# EasyEDA Pro project 06_B&RLight.epro

# Schematic Schematic1
Create Date: 2024-04-08; Page Name: P1; Project Name: Light; Schematic Name: Schematic1; Update Date: 2024-07-20; Company: 嘉立创EDA; Page Size: A3; Version: V1.0
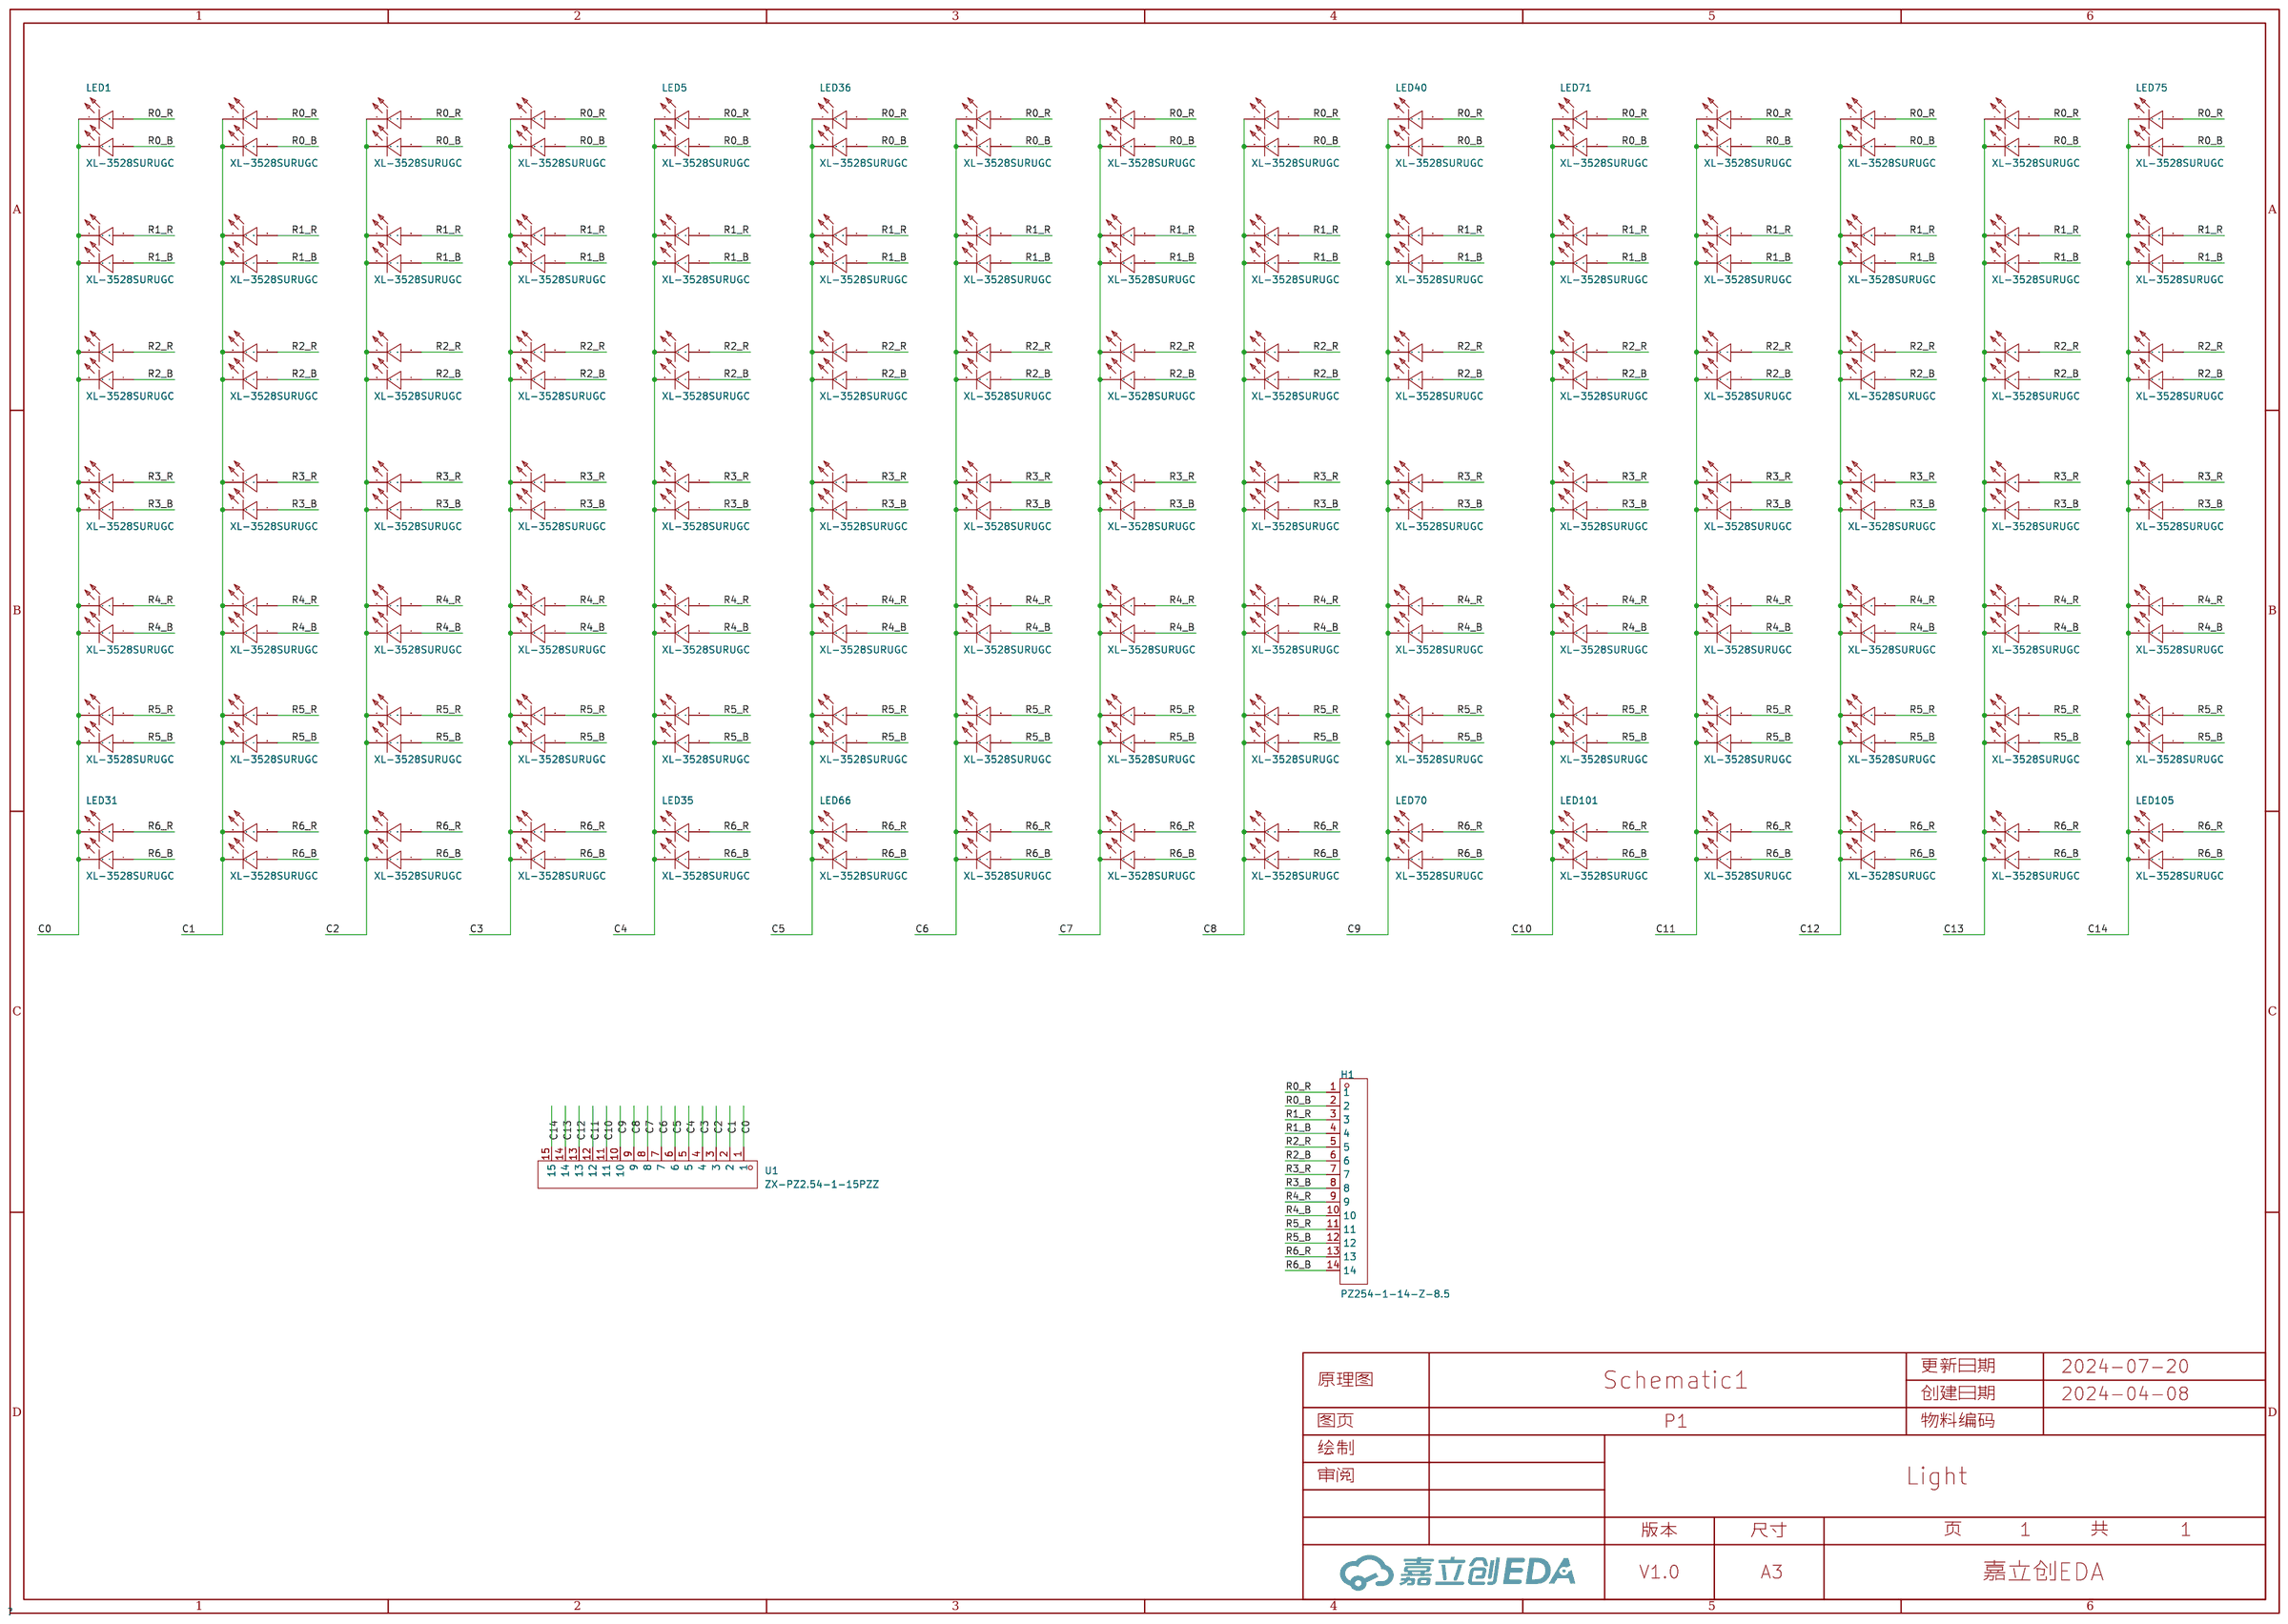
[diagram p0: schematic sheet]

## Parts
H1  PZ254-1-14-Z-8.5  [HDR-TH_14P-P2.54-V-M]
LED1  XL-3528SURUGC  [LED-SMD_4P-L3.2-W2.8-LS3.5-TL]
LED2  XL-3528SURUGC  [LED-SMD_4P-L3.2-W2.8-LS3.5-TL]
LED3  XL-3528SURUGC  [LED-SMD_4P-L3.2-W2.8-LS3.5-TL]
LED4  XL-3528SURUGC  [LED-SMD_4P-L3.2-W2.8-LS3.5-TL]
LED5  XL-3528SURUGC  [LED-SMD_4P-L3.2-W2.8-LS3.5-TL]
LED6  XL-3528SURUGC  [LED-SMD_4P-L3.2-W2.8-LS3.5-TL]
LED7  XL-3528SURUGC  [LED-SMD_4P-L3.2-W2.8-LS3.5-TL]
LED8  XL-3528SURUGC  [LED-SMD_4P-L3.2-W2.8-LS3.5-TL]
LED9  XL-3528SURUGC  [LED-SMD_4P-L3.2-W2.8-LS3.5-TL]
LED10  XL-3528SURUGC  [LED-SMD_4P-L3.2-W2.8-LS3.5-TL]
LED11  XL-3528SURUGC  [LED-SMD_4P-L3.2-W2.8-LS3.5-TL]
LED12  XL-3528SURUGC  [LED-SMD_4P-L3.2-W2.8-LS3.5-TL]
LED13  XL-3528SURUGC  [LED-SMD_4P-L3.2-W2.8-LS3.5-TL]
LED14  XL-3528SURUGC  [LED-SMD_4P-L3.2-W2.8-LS3.5-TL]
LED15  XL-3528SURUGC  [LED-SMD_4P-L3.2-W2.8-LS3.5-TL]
LED16  XL-3528SURUGC  [LED-SMD_4P-L3.2-W2.8-LS3.5-TL]
LED17  XL-3528SURUGC  [LED-SMD_4P-L3.2-W2.8-LS3.5-TL]
LED18  XL-3528SURUGC  [LED-SMD_4P-L3.2-W2.8-LS3.5-TL]
LED19  XL-3528SURUGC  [LED-SMD_4P-L3.2-W2.8-LS3.5-TL]
LED20  XL-3528SURUGC  [LED-SMD_4P-L3.2-W2.8-LS3.5-TL]
LED21  XL-3528SURUGC  [LED-SMD_4P-L3.2-W2.8-LS3.5-TL]
LED22  XL-3528SURUGC  [LED-SMD_4P-L3.2-W2.8-LS3.5-TL]
LED23  XL-3528SURUGC  [LED-SMD_4P-L3.2-W2.8-LS3.5-TL]
LED24  XL-3528SURUGC  [LED-SMD_4P-L3.2-W2.8-LS3.5-TL]
LED25  XL-3528SURUGC  [LED-SMD_4P-L3.2-W2.8-LS3.5-TL]
LED26  XL-3528SURUGC  [LED-SMD_4P-L3.2-W2.8-LS3.5-TL]
LED27  XL-3528SURUGC  [LED-SMD_4P-L3.2-W2.8-LS3.5-TL]
LED28  XL-3528SURUGC  [LED-SMD_4P-L3.2-W2.8-LS3.5-TL]
LED29  XL-3528SURUGC  [LED-SMD_4P-L3.2-W2.8-LS3.5-TL]
LED30  XL-3528SURUGC  [LED-SMD_4P-L3.2-W2.8-LS3.5-TL]
LED31  XL-3528SURUGC  [LED-SMD_4P-L3.2-W2.8-LS3.5-TL]
LED32  XL-3528SURUGC  [LED-SMD_4P-L3.2-W2.8-LS3.5-TL]
LED33  XL-3528SURUGC  [LED-SMD_4P-L3.2-W2.8-LS3.5-TL]
LED34  XL-3528SURUGC  [LED-SMD_4P-L3.2-W2.8-LS3.5-TL]
LED35  XL-3528SURUGC  [LED-SMD_4P-L3.2-W2.8-LS3.5-TL]
LED36  XL-3528SURUGC  [LED-SMD_4P-L3.2-W2.8-LS3.5-TL]
LED37  XL-3528SURUGC  [LED-SMD_4P-L3.2-W2.8-LS3.5-TL]
LED38  XL-3528SURUGC  [LED-SMD_4P-L3.2-W2.8-LS3.5-TL]
LED39  XL-3528SURUGC  [LED-SMD_4P-L3.2-W2.8-LS3.5-TL]
LED40  XL-3528SURUGC  [LED-SMD_4P-L3.2-W2.8-LS3.5-TL]
LED41  XL-3528SURUGC  [LED-SMD_4P-L3.2-W2.8-LS3.5-TL]
LED42  XL-3528SURUGC  [LED-SMD_4P-L3.2-W2.8-LS3.5-TL]
LED43  XL-3528SURUGC  [LED-SMD_4P-L3.2-W2.8-LS3.5-TL]
LED44  XL-3528SURUGC  [LED-SMD_4P-L3.2-W2.8-LS3.5-TL]
LED45  XL-3528SURUGC  [LED-SMD_4P-L3.2-W2.8-LS3.5-TL]
LED46  XL-3528SURUGC  [LED-SMD_4P-L3.2-W2.8-LS3.5-TL]
LED47  XL-3528SURUGC  [LED-SMD_4P-L3.2-W2.8-LS3.5-TL]
LED48  XL-3528SURUGC  [LED-SMD_4P-L3.2-W2.8-LS3.5-TL]
LED49  XL-3528SURUGC  [LED-SMD_4P-L3.2-W2.8-LS3.5-TL]
LED50  XL-3528SURUGC  [LED-SMD_4P-L3.2-W2.8-LS3.5-TL]
LED51  XL-3528SURUGC  [LED-SMD_4P-L3.2-W2.8-LS3.5-TL]
LED52  XL-3528SURUGC  [LED-SMD_4P-L3.2-W2.8-LS3.5-TL]
LED53  XL-3528SURUGC  [LED-SMD_4P-L3.2-W2.8-LS3.5-TL]
LED54  XL-3528SURUGC  [LED-SMD_4P-L3.2-W2.8-LS3.5-TL]
LED55  XL-3528SURUGC  [LED-SMD_4P-L3.2-W2.8-LS3.5-TL]
LED56  XL-3528SURUGC  [LED-SMD_4P-L3.2-W2.8-LS3.5-TL]
LED57  XL-3528SURUGC  [LED-SMD_4P-L3.2-W2.8-LS3.5-TL]
LED58  XL-3528SURUGC  [LED-SMD_4P-L3.2-W2.8-LS3.5-TL]
LED59  XL-3528SURUGC  [LED-SMD_4P-L3.2-W2.8-LS3.5-TL]
LED60  XL-3528SURUGC  [LED-SMD_4P-L3.2-W2.8-LS3.5-TL]
LED61  XL-3528SURUGC  [LED-SMD_4P-L3.2-W2.8-LS3.5-TL]
LED62  XL-3528SURUGC  [LED-SMD_4P-L3.2-W2.8-LS3.5-TL]
LED63  XL-3528SURUGC  [LED-SMD_4P-L3.2-W2.8-LS3.5-TL]
LED64  XL-3528SURUGC  [LED-SMD_4P-L3.2-W2.8-LS3.5-TL]
LED65  XL-3528SURUGC  [LED-SMD_4P-L3.2-W2.8-LS3.5-TL]
LED66  XL-3528SURUGC  [LED-SMD_4P-L3.2-W2.8-LS3.5-TL]
LED67  XL-3528SURUGC  [LED-SMD_4P-L3.2-W2.8-LS3.5-TL]
LED68  XL-3528SURUGC  [LED-SMD_4P-L3.2-W2.8-LS3.5-TL]
LED69  XL-3528SURUGC  [LED-SMD_4P-L3.2-W2.8-LS3.5-TL]
LED70  XL-3528SURUGC  [LED-SMD_4P-L3.2-W2.8-LS3.5-TL]
LED71  XL-3528SURUGC  [LED-SMD_4P-L3.2-W2.8-LS3.5-TL]
LED72  XL-3528SURUGC  [LED-SMD_4P-L3.2-W2.8-LS3.5-TL]
LED73  XL-3528SURUGC  [LED-SMD_4P-L3.2-W2.8-LS3.5-TL]
LED74  XL-3528SURUGC  [LED-SMD_4P-L3.2-W2.8-LS3.5-TL]
LED75  XL-3528SURUGC  [LED-SMD_4P-L3.2-W2.8-LS3.5-TL]
LED76  XL-3528SURUGC  [LED-SMD_4P-L3.2-W2.8-LS3.5-TL]
LED77  XL-3528SURUGC  [LED-SMD_4P-L3.2-W2.8-LS3.5-TL]
LED78  XL-3528SURUGC  [LED-SMD_4P-L3.2-W2.8-LS3.5-TL]
LED79  XL-3528SURUGC  [LED-SMD_4P-L3.2-W2.8-LS3.5-TL]
LED80  XL-3528SURUGC  [LED-SMD_4P-L3.2-W2.8-LS3.5-TL]
LED81  XL-3528SURUGC  [LED-SMD_4P-L3.2-W2.8-LS3.5-TL]
LED82  XL-3528SURUGC  [LED-SMD_4P-L3.2-W2.8-LS3.5-TL]
LED83  XL-3528SURUGC  [LED-SMD_4P-L3.2-W2.8-LS3.5-TL]
LED84  XL-3528SURUGC  [LED-SMD_4P-L3.2-W2.8-LS3.5-TL]
LED85  XL-3528SURUGC  [LED-SMD_4P-L3.2-W2.8-LS3.5-TL]
LED86  XL-3528SURUGC  [LED-SMD_4P-L3.2-W2.8-LS3.5-TL]
LED87  XL-3528SURUGC  [LED-SMD_4P-L3.2-W2.8-LS3.5-TL]
LED88  XL-3528SURUGC  [LED-SMD_4P-L3.2-W2.8-LS3.5-TL]
LED89  XL-3528SURUGC  [LED-SMD_4P-L3.2-W2.8-LS3.5-TL]
LED90  XL-3528SURUGC  [LED-SMD_4P-L3.2-W2.8-LS3.5-TL]
LED91  XL-3528SURUGC  [LED-SMD_4P-L3.2-W2.8-LS3.5-TL]
LED92  XL-3528SURUGC  [LED-SMD_4P-L3.2-W2.8-LS3.5-TL]
LED93  XL-3528SURUGC  [LED-SMD_4P-L3.2-W2.8-LS3.5-TL]
LED94  XL-3528SURUGC  [LED-SMD_4P-L3.2-W2.8-LS3.5-TL]
LED95  XL-3528SURUGC  [LED-SMD_4P-L3.2-W2.8-LS3.5-TL]
LED96  XL-3528SURUGC  [LED-SMD_4P-L3.2-W2.8-LS3.5-TL]
LED97  XL-3528SURUGC  [LED-SMD_4P-L3.2-W2.8-LS3.5-TL]
LED98  XL-3528SURUGC  [LED-SMD_4P-L3.2-W2.8-LS3.5-TL]
LED99  XL-3528SURUGC  [LED-SMD_4P-L3.2-W2.8-LS3.5-TL]
LED100  XL-3528SURUGC  [LED-SMD_4P-L3.2-W2.8-LS3.5-TL]
LED101  XL-3528SURUGC  [LED-SMD_4P-L3.2-W2.8-LS3.5-TL]
LED102  XL-3528SURUGC  [LED-SMD_4P-L3.2-W2.8-LS3.5-TL]
LED103  XL-3528SURUGC  [LED-SMD_4P-L3.2-W2.8-LS3.5-TL]
LED104  XL-3528SURUGC  [LED-SMD_4P-L3.2-W2.8-LS3.5-TL]
LED105  XL-3528SURUGC  [LED-SMD_4P-L3.2-W2.8-LS3.5-TL]
U1  ZX-PZ2.54-1-15PZZ  [HDR-TH_15P-P2.54-V-M]

## Library data of the parts
H1 = PZ254-1-14-Z-8.5: 插针结构:1x14P;间距:2.54mm;行距:-;圆针/方针:方针;安装类型:直插;排数:单排;总PIN位数:14P;额定电流:3A;额定电压:-;配合针长度:6mm;塑高:2.5mm;端接针长度:3mm;触头材质:黄铜;工作温度范围:-40℃~+105℃;焊接温度(最大值):260℃@10S;颜色:黑色;; LCSC Part Name: 1x14P 间距:2.54mm 方针 直插; Supplier Part: C2894937; Manufacturer: HCTL(华灿天禄); Supplier Footprint: 插件,P=2.54mm; JLCPCB Part Class: Extended Part; Datasheet: https://atta.szlcsc.com/upload/public/pdf/source/20240305/0F0A2A5C422E5D195558C9C26715A031.pdf; Supplier: LCSC; Pin Structure: 1x14P; Pitch: 2.54mm; Circluar Pins/Square Pins: 方针; Mounting Type: 直插; Number of Rows: 单排; Number of Pins: 14P; Current Rating (Max): 3A; Length of Mating Pin: 6mm; Insulation Height: 2.5mm; Length of End Connection Pin: 3mm; Contact Material: 黄铜; Operating Temperature Range: -40℃~+105℃; Soldering Temperature(Max): 260℃@10S; Color: 黑色
LED1-LED105 = XL-3528SURUGC: 发光颜色:红色,翠绿色;功率:90mW；90mW;正向电流:30mA;主波长:520nm~522.5nm；620nm~625nm;二极管配置:-;透镜颜色:无色透明透镜;发光角度:120°;载带方式:正贴;工作温度:-30℃~+85℃;; Supplier Part: C2843810; Manufacturer: XINGLIGHT(成兴光); Supplier Footprint: SMD3528; JLCPCB Part Class: 扩展库; Datasheet: https://atta.szlcsc.com/upload/public/pdf/source/20221102/F90D461D3395F167E4A274E460079459.pdf; Supplier: LCSC; Emitted Color: 红色,翠绿色; Power Dissipation: 90mW；90mW; Forward Current: 30mA; Dominant Wavelength: 520nm~522.5nm；620nm~625nm; Peak Wavelength: 522.5nm；625nm; Lens Color: 无色透明透镜; Viewing Angle: 120°; Mounting Sytle: 正贴; Operating Temperature: -30℃~+85℃
U1 = ZX-PZ2.54-1-15PZZ: 插针结构:1x15P;间距:2.54mm;行距:-;圆针/方针:方针;安装类型:直插;排数:单排;总PIN位数:15P;额定电流:3A;额定电压:1kV;配合针长度:6mm;塑高:2.5mm;端接针长度:3mm;触头材质:黄铜;触头镀层:金;工作温度范围:-40℃~+105℃;焊接温度(最大值):-;颜色:黑色;; LCSC Part Name: 1x15P 间距:2.54mm 方针 直插; Supplier Part: C7501269; Manufacturer: Megastar(兆星); Supplier Footprint: 插件,P=2.54mm; JLCPCB Part Class: Extended Part; Datasheet: https://atta.szlcsc.com/upload/public/pdf/source/20231122/A1A587BCB61FD4E661A7B23F28C6B7B8.pdf; Supplier: LCSC; Pin Structure: 1x15P; Pitch: 2.54mm; Circluar Pins/Square Pins: 方针; Mounting Type: 直插; Number of Rows: 单排; Number of Pins: 15P; Current Rating (Max): 3A; Voltage Rating (Max): 1kV; Length of Mating Pin: 6mm; Insulation Height: 2.5mm; Length of End Connection Pin: 3mm; Contact Material: 黄铜; Contact Plating: 金; Operating Temperature Range: -40℃~+105℃; Color: 黑色

## Nets
C0: LED1.1 LED1.3 LED6.1 LED6.3 LED11.1 LED11.3 LED16.1 LED16.3 LED21.1 LED21.3 LED26.1 LED26.3 LED31.1 LED31.3 U1.1
C1: LED2.1 LED2.3 LED7.1 LED7.3 LED12.1 LED12.3 LED17.1 LED17.3 LED22.1 LED22.3 LED27.1 LED27.3 LED32.1 LED32.3 U1.2
C2: LED3.1 LED3.3 LED8.1 LED8.3 LED13.1 LED13.3 LED18.1 LED18.3 LED23.1 LED23.3 LED28.1 LED28.3 LED33.1 LED33.3 U1.3
C3: LED4.1 LED4.3 LED9.1 LED9.3 LED14.1 LED14.3 LED19.1 LED19.3 LED24.1 LED24.3 LED29.1 LED29.3 LED34.1 LED34.3 U1.4
C4: LED5.1 LED5.3 LED10.1 LED10.3 LED15.1 LED15.3 LED20.1 LED20.3 LED25.1 LED25.3 LED30.1 LED30.3 LED35.1 LED35.3 U1.5
C5: LED36.1 LED36.3 LED41.1 LED41.3 LED46.1 LED46.3 LED51.1 LED51.3 LED56.1 LED56.3 LED61.1 LED61.3 LED66.1 LED66.3 U1.6
C6: LED37.1 LED37.3 LED42.1 LED42.3 LED47.1 LED47.3 LED52.1 LED52.3 LED57.1 LED57.3 LED62.1 LED62.3 LED67.1 LED67.3 U1.7
C7: LED38.1 LED38.3 LED43.1 LED43.3 LED48.1 LED48.3 LED53.1 LED53.3 LED58.1 LED58.3 LED63.1 LED63.3 LED68.1 LED68.3 U1.8
C8: LED39.1 LED39.3 LED44.1 LED44.3 LED49.1 LED49.3 LED54.1 LED54.3 LED59.1 LED59.3 LED64.1 LED64.3 LED69.1 LED69.3 U1.9
C9: LED40.1 LED40.3 LED45.1 LED45.3 LED50.1 LED50.3 LED55.1 LED55.3 LED60.1 LED60.3 LED65.1 LED65.3 LED70.1 LED70.3 U1.10
C10: LED71.1 LED71.3 LED76.1 LED76.3 LED81.1 LED81.3 LED86.1 LED86.3 LED91.1 LED91.3 LED96.1 LED96.3 LED101.1 LED101.3 U1.11
C11: LED72.1 LED72.3 LED77.1 LED77.3 LED82.1 LED82.3 LED87.1 LED87.3 LED92.1 LED92.3 LED97.1 LED97.3 LED102.1 LED102.3 U1.12
C12: LED73.1 LED73.3 LED78.1 LED78.3 LED83.1 LED83.3 LED88.1 LED88.3 LED93.1 LED93.3 LED98.1 LED98.3 LED103.1 LED103.3 U1.13
C13: LED74.1 LED74.3 LED79.1 LED79.3 LED84.1 LED84.3 LED89.1 LED89.3 LED94.1 LED94.3 LED99.1 LED99.3 LED104.1 LED104.3 U1.14
C14: LED75.1 LED75.3 LED80.1 LED80.3 LED85.1 LED85.3 LED90.1 LED90.3 LED95.1 LED95.3 LED100.1 LED100.3 LED105.1 LED105.3 U1.15
R0_B: H1.2 LED1.4 LED2.4 LED3.4 LED4.4 LED5.4 LED36.4 LED37.4 LED38.4 LED39.4 LED40.4 LED71.4 LED72.4 LED73.4 LED74.4 LED75.4
R0_R: H1.1 LED1.2 LED2.2 LED3.2 LED4.2 LED5.2 LED36.2 LED37.2 LED38.2 LED39.2 LED40.2 LED71.2 LED72.2 LED73.2 LED74.2 LED75.2
R1_B: H1.4 LED6.4 LED7.4 LED8.4 LED9.4 LED10.4 LED41.4 LED42.4 LED43.4 LED44.4 LED45.4 LED76.4 LED77.4 LED78.4 LED79.4 LED80.4
R1_R: H1.3 LED6.2 LED7.2 LED8.2 LED9.2 LED10.2 LED41.2 LED42.2 LED43.2 LED44.2 LED45.2 LED76.2 LED77.2 LED78.2 LED79.2 LED80.2
R2_B: H1.6 LED11.4 LED12.4 LED13.4 LED14.4 LED15.4 LED46.4 LED47.4 LED48.4 LED49.4 LED50.4 LED81.4 LED82.4 LED83.4 LED84.4 LED85.4
R2_R: H1.5 LED11.2 LED12.2 LED13.2 LED14.2 LED15.2 LED46.2 LED47.2 LED48.2 LED49.2 LED50.2 LED81.2 LED82.2 LED83.2 LED84.2 LED85.2
R3_B: H1.8 LED16.4 LED17.4 LED18.4 LED19.4 LED20.4 LED51.4 LED52.4 LED53.4 LED54.4 LED55.4 LED86.4 LED87.4 LED88.4 LED89.4 LED90.4
R3_R: H1.7 LED16.2 LED17.2 LED18.2 LED19.2 LED20.2 LED51.2 LED52.2 LED53.2 LED54.2 LED55.2 LED86.2 LED87.2 LED88.2 LED89.2 LED90.2
R4_B: H1.10 LED21.4 LED22.4 LED23.4 LED24.4 LED25.4 LED56.4 LED57.4 LED58.4 LED59.4 LED60.4 LED91.4 LED92.4 LED93.4 LED94.4 LED95.4
R4_R: H1.9 LED21.2 LED22.2 LED23.2 LED24.2 LED25.2 LED56.2 LED57.2 LED58.2 LED59.2 LED60.2 LED91.2 LED92.2 LED93.2 LED94.2 LED95.2
R5_B: H1.12 LED26.4 LED27.4 LED28.4 LED29.4 LED30.4 LED61.4 LED62.4 LED63.4 LED64.4 LED65.4 LED96.4 LED97.4 LED98.4 LED99.4 LED100.4
R5_R: H1.11 LED26.2 LED27.2 LED28.2 LED29.2 LED30.2 LED61.2 LED62.2 LED63.2 LED64.2 LED65.2 LED96.2 LED97.2 LED98.2 LED99.2 LED100.2
R6_B: H1.14 LED31.4 LED32.4 LED33.4 LED34.4 LED35.4 LED66.4 LED67.4 LED68.4 LED69.4 LED70.4 LED101.4 LED102.4 LED103.4 LED104.4 LED105.4
R6_R: H1.13 LED31.2 LED32.2 LED33.2 LED34.2 LED35.2 LED66.2 LED67.2 LED68.2 LED69.2 LED70.2 LED101.2 LED102.2 LED103.2 LED104.2 LED105.2

# Board PCB1
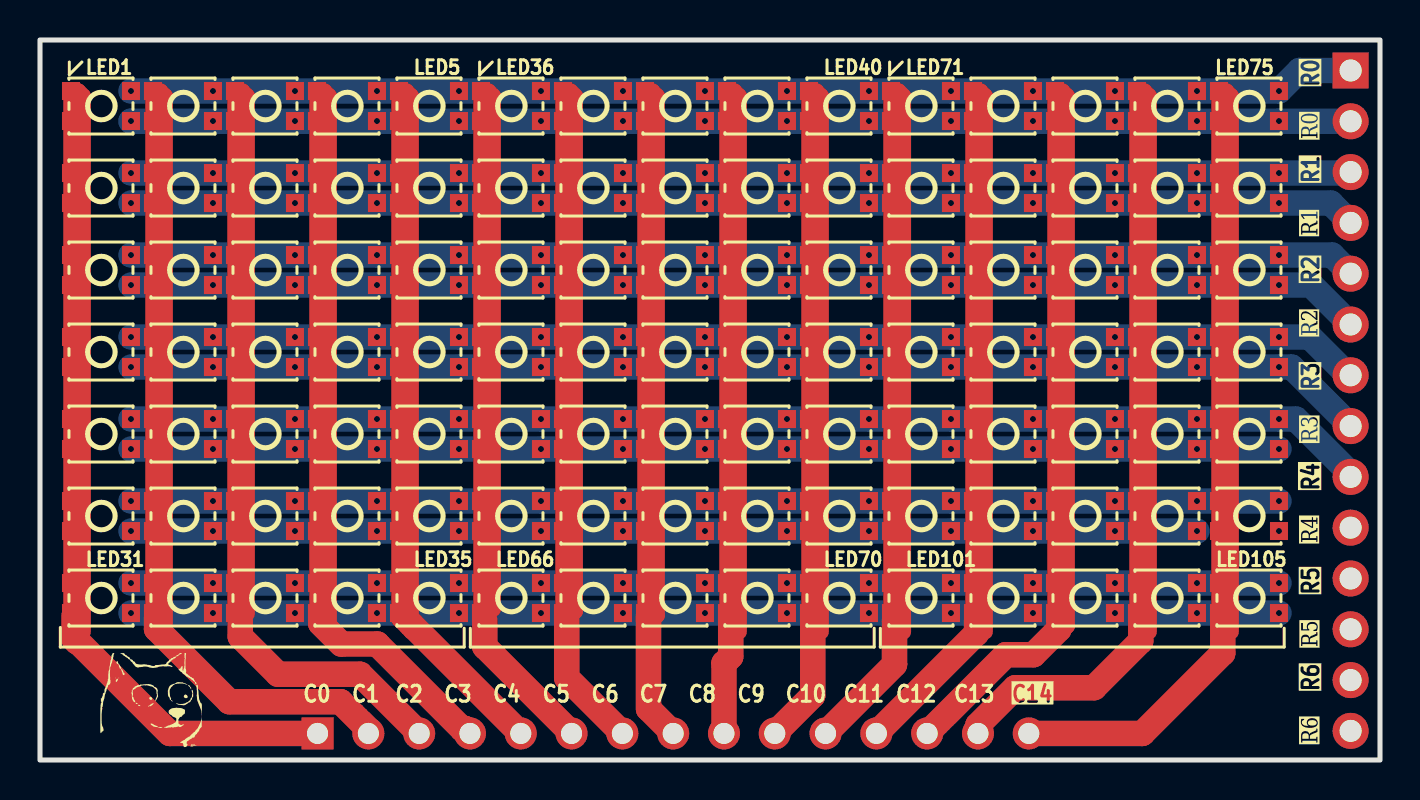
[diagram p1: board, top side]
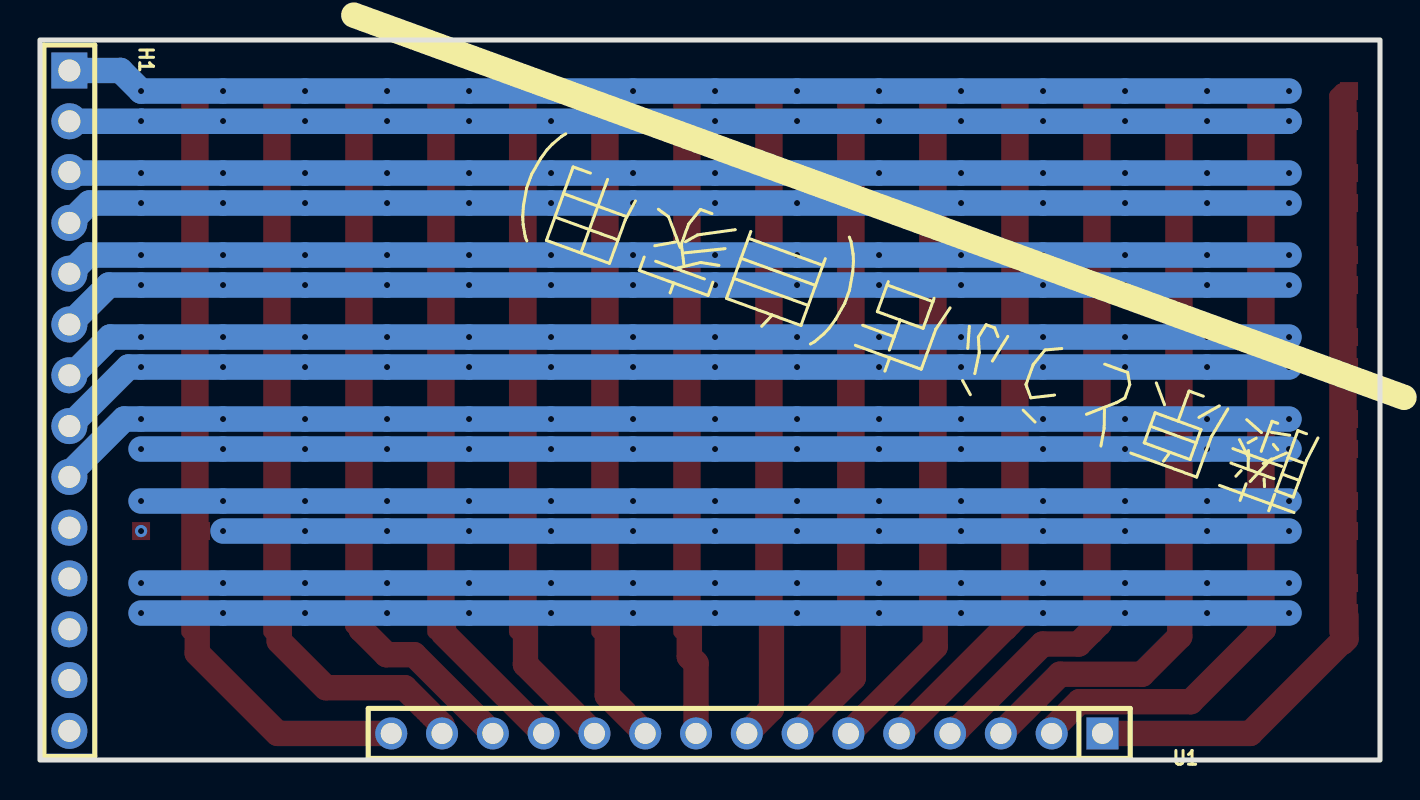
[diagram p2: board, bottom side, seen from below]

Outline 67 x 36 mm; copper layers: Top Layer, Bottom Layer. Coordinates in mm from the lower left corner of the outline.
Outline path: rectangle 0,36 67,0
Stack: Top Layer 0.035mm / Dielectric1 1.51mm FR4 er 4.5 / Bottom Layer 0.035mm

## Design rules (mm)
template: 自定义配置
spacing copperThickness1oz (default): track to track 0.102, other pairs 0.152 to 0.3
spacing copperThickness2oz: track to track 0.203, other pairs 0.152 to 0.3
track width copperThickness1oz (default): min 0.381, default 0.762, max 2.54
track width copperThickness2oz: min 0.203, default 0.254, max 2.54
differential pair differentialPair (default): width min 0.127, default 0.254, max 2.54; gap min 0.152, default 0.152
via viaSize (default): diameter min 0.5, default 0.61, max 10; hole min 0.3, default 0.305, max 6.299
pour e331 uses FULL
pour e396 uses FULL
pour e444 uses FULL
pour e490 uses FULL
pour e495 uses FULL
pour e208 uses FULL

## Placement (name value [footprint] x y rotation side)
H1  PZ254-1-14-Z-8.5  [HDR-TH_14P-P2.54-V-M]  65.53 17.97 270 bottom
LED1  XL-3528SURUGC  [LED-SMD_4P-L3.2-W2.8-LS3.5-TL]  3.05 32.7 0 top
LED2  XL-3528SURUGC  [LED-SMD_4P-L3.2-W2.8-LS3.5-TL]  7.15 32.7 0 top
LED3  XL-3528SURUGC  [LED-SMD_4P-L3.2-W2.8-LS3.5-TL]  11.25 32.7 0 top
LED4  XL-3528SURUGC  [LED-SMD_4P-L3.2-W2.8-LS3.5-TL]  15.35 32.7 0 top
LED5  XL-3528SURUGC  [LED-SMD_4P-L3.2-W2.8-LS3.5-TL]  19.45 32.7 0 top
LED6  XL-3528SURUGC  [LED-SMD_4P-L3.2-W2.8-LS3.5-TL]  3.05 28.6 0 top
LED7  XL-3528SURUGC  [LED-SMD_4P-L3.2-W2.8-LS3.5-TL]  7.15 28.6 0 top
LED8  XL-3528SURUGC  [LED-SMD_4P-L3.2-W2.8-LS3.5-TL]  11.25 28.6 0 top
LED9  XL-3528SURUGC  [LED-SMD_4P-L3.2-W2.8-LS3.5-TL]  15.35 28.6 0 top
LED10  XL-3528SURUGC  [LED-SMD_4P-L3.2-W2.8-LS3.5-TL]  19.45 28.6 0 top
LED11  XL-3528SURUGC  [LED-SMD_4P-L3.2-W2.8-LS3.5-TL]  3.05 24.5 0 top
LED12  XL-3528SURUGC  [LED-SMD_4P-L3.2-W2.8-LS3.5-TL]  7.15 24.5 0 top
LED13  XL-3528SURUGC  [LED-SMD_4P-L3.2-W2.8-LS3.5-TL]  11.25 24.5 0 top
LED14  XL-3528SURUGC  [LED-SMD_4P-L3.2-W2.8-LS3.5-TL]  15.35 24.5 0 top
LED15  XL-3528SURUGC  [LED-SMD_4P-L3.2-W2.8-LS3.5-TL]  19.45 24.5 0 top
LED16  XL-3528SURUGC  [LED-SMD_4P-L3.2-W2.8-LS3.5-TL]  3.05 20.4 0 top
LED17  XL-3528SURUGC  [LED-SMD_4P-L3.2-W2.8-LS3.5-TL]  7.15 20.4 0 top
LED18  XL-3528SURUGC  [LED-SMD_4P-L3.2-W2.8-LS3.5-TL]  11.25 20.4 0 top
LED19  XL-3528SURUGC  [LED-SMD_4P-L3.2-W2.8-LS3.5-TL]  15.35 20.4 0 top
LED20  XL-3528SURUGC  [LED-SMD_4P-L3.2-W2.8-LS3.5-TL]  19.45 20.4 0 top
LED21  XL-3528SURUGC  [LED-SMD_4P-L3.2-W2.8-LS3.5-TL]  3.05 16.3 0 top
LED22  XL-3528SURUGC  [LED-SMD_4P-L3.2-W2.8-LS3.5-TL]  7.15 16.3 0 top
LED23  XL-3528SURUGC  [LED-SMD_4P-L3.2-W2.8-LS3.5-TL]  11.25 16.3 0 top
LED24  XL-3528SURUGC  [LED-SMD_4P-L3.2-W2.8-LS3.5-TL]  15.35 16.3 0 top
LED25  XL-3528SURUGC  [LED-SMD_4P-L3.2-W2.8-LS3.5-TL]  19.45 16.3 0 top
LED26  XL-3528SURUGC  [LED-SMD_4P-L3.2-W2.8-LS3.5-TL]  3.05 12.2 0 top
LED27  XL-3528SURUGC  [LED-SMD_4P-L3.2-W2.8-LS3.5-TL]  7.15 12.2 0 top
LED28  XL-3528SURUGC  [LED-SMD_4P-L3.2-W2.8-LS3.5-TL]  11.25 12.2 0 top
LED29  XL-3528SURUGC  [LED-SMD_4P-L3.2-W2.8-LS3.5-TL]  15.35 12.2 0 top
LED30  XL-3528SURUGC  [LED-SMD_4P-L3.2-W2.8-LS3.5-TL]  19.45 12.2 0 top
LED31  XL-3528SURUGC  [LED-SMD_4P-L3.2-W2.8-LS3.5-TL]  3.05 8.1 0 top
LED32  XL-3528SURUGC  [LED-SMD_4P-L3.2-W2.8-LS3.5-TL]  7.15 8.1 0 top
LED33  XL-3528SURUGC  [LED-SMD_4P-L3.2-W2.8-LS3.5-TL]  11.25 8.1 0 top
LED34  XL-3528SURUGC  [LED-SMD_4P-L3.2-W2.8-LS3.5-TL]  15.35 8.1 0 top
LED35  XL-3528SURUGC  [LED-SMD_4P-L3.2-W2.8-LS3.5-TL]  19.45 8.1 0 top
LED36  XL-3528SURUGC  [LED-SMD_4P-L3.2-W2.8-LS3.5-TL]  23.55 32.7 0 top
LED37  XL-3528SURUGC  [LED-SMD_4P-L3.2-W2.8-LS3.5-TL]  27.65 32.7 0 top
LED38  XL-3528SURUGC  [LED-SMD_4P-L3.2-W2.8-LS3.5-TL]  31.75 32.7 0 top
LED39  XL-3528SURUGC  [LED-SMD_4P-L3.2-W2.8-LS3.5-TL]  35.85 32.7 0 top
LED40  XL-3528SURUGC  [LED-SMD_4P-L3.2-W2.8-LS3.5-TL]  39.95 32.7 0 top
LED41  XL-3528SURUGC  [LED-SMD_4P-L3.2-W2.8-LS3.5-TL]  23.55 28.6 0 top
LED42  XL-3528SURUGC  [LED-SMD_4P-L3.2-W2.8-LS3.5-TL]  27.65 28.6 0 top
LED43  XL-3528SURUGC  [LED-SMD_4P-L3.2-W2.8-LS3.5-TL]  31.75 28.6 0 top
LED44  XL-3528SURUGC  [LED-SMD_4P-L3.2-W2.8-LS3.5-TL]  35.85 28.6 0 top
LED45  XL-3528SURUGC  [LED-SMD_4P-L3.2-W2.8-LS3.5-TL]  39.95 28.6 0 top
LED46  XL-3528SURUGC  [LED-SMD_4P-L3.2-W2.8-LS3.5-TL]  23.55 24.5 0 top
LED47  XL-3528SURUGC  [LED-SMD_4P-L3.2-W2.8-LS3.5-TL]  27.65 24.5 0 top
LED48  XL-3528SURUGC  [LED-SMD_4P-L3.2-W2.8-LS3.5-TL]  31.75 24.5 0 top
LED49  XL-3528SURUGC  [LED-SMD_4P-L3.2-W2.8-LS3.5-TL]  35.85 24.5 0 top
LED50  XL-3528SURUGC  [LED-SMD_4P-L3.2-W2.8-LS3.5-TL]  39.95 24.5 0 top
LED51  XL-3528SURUGC  [LED-SMD_4P-L3.2-W2.8-LS3.5-TL]  23.55 20.4 0 top
LED52  XL-3528SURUGC  [LED-SMD_4P-L3.2-W2.8-LS3.5-TL]  27.65 20.4 0 top
LED53  XL-3528SURUGC  [LED-SMD_4P-L3.2-W2.8-LS3.5-TL]  31.75 20.4 0 top
LED54  XL-3528SURUGC  [LED-SMD_4P-L3.2-W2.8-LS3.5-TL]  35.85 20.4 0 top
LED55  XL-3528SURUGC  [LED-SMD_4P-L3.2-W2.8-LS3.5-TL]  39.95 20.4 0 top
LED56  XL-3528SURUGC  [LED-SMD_4P-L3.2-W2.8-LS3.5-TL]  23.55 16.3 0 top
LED57  XL-3528SURUGC  [LED-SMD_4P-L3.2-W2.8-LS3.5-TL]  27.65 16.3 0 top
LED58  XL-3528SURUGC  [LED-SMD_4P-L3.2-W2.8-LS3.5-TL]  31.75 16.3 0 top
LED59  XL-3528SURUGC  [LED-SMD_4P-L3.2-W2.8-LS3.5-TL]  35.85 16.3 0 top
LED60  XL-3528SURUGC  [LED-SMD_4P-L3.2-W2.8-LS3.5-TL]  39.95 16.3 0 top
LED61  XL-3528SURUGC  [LED-SMD_4P-L3.2-W2.8-LS3.5-TL]  23.55 12.2 0 top
LED62  XL-3528SURUGC  [LED-SMD_4P-L3.2-W2.8-LS3.5-TL]  27.65 12.2 0 top
LED63  XL-3528SURUGC  [LED-SMD_4P-L3.2-W2.8-LS3.5-TL]  31.75 12.2 0 top
LED64  XL-3528SURUGC  [LED-SMD_4P-L3.2-W2.8-LS3.5-TL]  35.85 12.2 0 top
LED65  XL-3528SURUGC  [LED-SMD_4P-L3.2-W2.8-LS3.5-TL]  39.95 12.2 0 top
LED66  XL-3528SURUGC  [LED-SMD_4P-L3.2-W2.8-LS3.5-TL]  23.55 8.1 0 top
LED67  XL-3528SURUGC  [LED-SMD_4P-L3.2-W2.8-LS3.5-TL]  27.65 8.1 0 top
LED68  XL-3528SURUGC  [LED-SMD_4P-L3.2-W2.8-LS3.5-TL]  31.75 8.1 0 top
LED69  XL-3528SURUGC  [LED-SMD_4P-L3.2-W2.8-LS3.5-TL]  35.85 8.1 0 top
LED70  XL-3528SURUGC  [LED-SMD_4P-L3.2-W2.8-LS3.5-TL]  39.95 8.1 0 top
LED71  XL-3528SURUGC  [LED-SMD_4P-L3.2-W2.8-LS3.5-TL]  44.05 32.7 0 top
LED72  XL-3528SURUGC  [LED-SMD_4P-L3.2-W2.8-LS3.5-TL]  48.15 32.7 0 top
LED73  XL-3528SURUGC  [LED-SMD_4P-L3.2-W2.8-LS3.5-TL]  52.25 32.7 0 top
LED74  XL-3528SURUGC  [LED-SMD_4P-L3.2-W2.8-LS3.5-TL]  56.35 32.7 0 top
LED75  XL-3528SURUGC  [LED-SMD_4P-L3.2-W2.8-LS3.5-TL]  60.45 32.7 0 top
LED76  XL-3528SURUGC  [LED-SMD_4P-L3.2-W2.8-LS3.5-TL]  44.05 28.6 0 top
LED77  XL-3528SURUGC  [LED-SMD_4P-L3.2-W2.8-LS3.5-TL]  48.15 28.6 0 top
LED78  XL-3528SURUGC  [LED-SMD_4P-L3.2-W2.8-LS3.5-TL]  52.25 28.6 0 top
LED79  XL-3528SURUGC  [LED-SMD_4P-L3.2-W2.8-LS3.5-TL]  56.35 28.6 0 top
LED80  XL-3528SURUGC  [LED-SMD_4P-L3.2-W2.8-LS3.5-TL]  60.45 28.6 0 top
LED81  XL-3528SURUGC  [LED-SMD_4P-L3.2-W2.8-LS3.5-TL]  44.05 24.5 0 top
LED82  XL-3528SURUGC  [LED-SMD_4P-L3.2-W2.8-LS3.5-TL]  48.15 24.5 0 top
LED83  XL-3528SURUGC  [LED-SMD_4P-L3.2-W2.8-LS3.5-TL]  52.25 24.5 0 top
LED84  XL-3528SURUGC  [LED-SMD_4P-L3.2-W2.8-LS3.5-TL]  56.35 24.5 0 top
LED85  XL-3528SURUGC  [LED-SMD_4P-L3.2-W2.8-LS3.5-TL]  60.45 24.5 0 top
LED86  XL-3528SURUGC  [LED-SMD_4P-L3.2-W2.8-LS3.5-TL]  44.05 20.4 0 top
LED87  XL-3528SURUGC  [LED-SMD_4P-L3.2-W2.8-LS3.5-TL]  48.15 20.4 0 top
LED88  XL-3528SURUGC  [LED-SMD_4P-L3.2-W2.8-LS3.5-TL]  52.25 20.4 0 top
LED89  XL-3528SURUGC  [LED-SMD_4P-L3.2-W2.8-LS3.5-TL]  56.35 20.4 0 top
LED90  XL-3528SURUGC  [LED-SMD_4P-L3.2-W2.8-LS3.5-TL]  60.45 20.4 0 top
LED91  XL-3528SURUGC  [LED-SMD_4P-L3.2-W2.8-LS3.5-TL]  44.05 16.3 0 top
LED92  XL-3528SURUGC  [LED-SMD_4P-L3.2-W2.8-LS3.5-TL]  48.15 16.3 0 top
LED93  XL-3528SURUGC  [LED-SMD_4P-L3.2-W2.8-LS3.5-TL]  52.25 16.3 0 top
LED94  XL-3528SURUGC  [LED-SMD_4P-L3.2-W2.8-LS3.5-TL]  56.35 16.3 0 top
LED95  XL-3528SURUGC  [LED-SMD_4P-L3.2-W2.8-LS3.5-TL]  60.45 16.3 0 top
LED96  XL-3528SURUGC  [LED-SMD_4P-L3.2-W2.8-LS3.5-TL]  44.05 12.2 0 top
LED97  XL-3528SURUGC  [LED-SMD_4P-L3.2-W2.8-LS3.5-TL]  48.15 12.2 0 top
LED98  XL-3528SURUGC  [LED-SMD_4P-L3.2-W2.8-LS3.5-TL]  52.25 12.2 0 top
LED99  XL-3528SURUGC  [LED-SMD_4P-L3.2-W2.8-LS3.5-TL]  56.35 12.2 0 top
LED100  XL-3528SURUGC  [LED-SMD_4P-L3.2-W2.8-LS3.5-TL]  60.45 12.2 0 top
LED101  XL-3528SURUGC  [LED-SMD_4P-L3.2-W2.8-LS3.5-TL]  44.05 8.1 0 top
LED102  XL-3528SURUGC  [LED-SMD_4P-L3.2-W2.8-LS3.5-TL]  48.15 8.1 0 top
LED103  XL-3528SURUGC  [LED-SMD_4P-L3.2-W2.8-LS3.5-TL]  52.25 8.1 0 top
LED104  XL-3528SURUGC  [LED-SMD_4P-L3.2-W2.8-LS3.5-TL]  56.35 8.1 0 top
LED105  XL-3528SURUGC  [LED-SMD_4P-L3.2-W2.8-LS3.5-TL]  60.45 8.1 0 top
U1  ZX-PZ2.54-1-15PZZ  [HDR-TH_15P-P2.54-V-M]  31.66 1.33 0 bottom

## Footprints (pads in the part's own frame, mm; a bottom-side part is the same pattern mirrored in y, then rotated)
HDR-TH_14P-P2.54-V-M
  rect 1.8x1.8 hole 1.1: 1(-16.51,0)
  round 1.8 hole 1.1: 2(-13.97,0) 3(-11.43,0) 4(-8.89,0) 5(-6.35,0) 6(-3.81,0) 7(-1.27,0) 8(1.27,0) 9(3.81,0) 10(6.35,0) 11(8.89,0) 12(11.43,0) 13(13.97,0) 14(16.51,0)
HDR-TH_15P-P2.54-V-M
  rect 1.6x1.6 hole 1.05: 1(-17.78,0)
  round 1.6 hole 1.05: 2(-15.24,0) 3(-12.7,0) 4(-10.16,0) 5(-7.62,0) 6(-5.08,0) 7(-2.54,0) 8(0,0) 9(2.54,0) 10(5.08,0) 11(7.62,0) 12(10.16,0) 13(12.7,0) 14(15.24,0) 15(17.78,0)
LED-SMD_4P-L3.2-W2.8-LS3.5-TL
  rect 0.9x0.9 smd: 1(-1.5,0.75) 2(1.5,0.75) 3(-1.5,-0.75) 4(1.5,-0.75)

## Nets
As in the schematic.

## Via types
v1: diameter 0.61, hole 0.305, Top Layer to Bottom Layer, 210 vias

## Routing (per net, layer and track width the routed paths; a pad name or vN(x,y) marks a point on that pad's centre or on a via; arc(x,y) is an arc through that point)
C0: length 68.9
  Top Layer w0.762: LED31.3 LED31.1 LED26.3 LED26.1 LED21.3 LED21.1 LED16.3 LED16.1 LED11.3 LED11.1 LED6.3 LED6.1 LED1.3 LED1.1 1.92,33.45 2.16,33.21 2.16,6.41
  Top Layer w1.27: U1.1 6.49,1.33 1.93,5.89 1.87,5.89 1.7,6.06 1.7,7.18
C1: length 67
  Top Layer w0.762: 6.26,6.41 6.26,33.21 6.02,33.45 LED2.1 LED2.3 LED7.1 LED7.3 LED12.1 LED12.3 LED17.1 LED17.3 LED22.1 LED22.3 LED27.1 LED27.3 LED32.1 LED32.3
  Top Layer w1.27: 5.83,7.09 5.83,6.55 9.46,2.92 15.03,2.92 16.42,1.53 U1.2
C2: length 64.4
  Top Layer w0.762: 10.36,7.32 10.36,33.21 10.12,33.45 LED3.1 LED3.3 LED8.1 LED8.3 LED13.1 LED13.3 LED18.1 LED18.3 LED23.1 LED23.3 LED28.1 LED28.3 LED33.1 LED33.3
  Top Layer w1.27: U1.3 16,4.29 11.9,4.29 10.01,6.18 10.01,6.94
C3: length 63.7
  Top Layer w0.762: 14.46,6.41 14.46,33.21 14.22,33.45 LED4.1 LED4.3 LED9.1 LED9.3 LED14.1 LED14.3 LED19.1 LED19.3 LED24.1 LED24.3 LED29.1 LED29.3 LED34.1 13.85,7.54 13.84,7.53
  Top Layer w1.27: U1.4 21.25,1.58 21.11,1.55 16.86,5.8 15.07,5.8 14.46,6.41 14.04,6.83 14.04,7.31
C4: length 62
  Top Layer w0.762: 18.56,6.41 18.56,33.21 18.32,33.45 LED5.1 LED5.3 LED10.1 LED10.3 LED15.1 LED15.3 LED20.1 LED20.3 LED25.1 LED25.3 LED30.1 LED30.3 LED35.1 LED35.3
  Top Layer w1.27: 18.15,7.22 18.15,7.2 18.56,6.79 24.03,1.32
C5: length 60.4
  Top Layer w0.762: 22.05,33.45 22.42,33.45 22.66,33.21 22.66,7.55 22.3,7.19 ; LED66.3 LED66.1 LED61.3 LED61.1 LED56.3 LED56.1 LED51.3 LED51.1 LED46.3 LED46.1 LED41.3 LED41.1 LED36.3 LED36.1
  Top Layer w1.27: 22.24,6.97 22.24,5.67 U1.6
C6: length 59.8
  Top Layer w0.762: 26.15,33.45 26.52,33.45 26.76,33.21 26.76,7.43 26.53,7.2 ; LED37.1 LED37.3 LED42.1 LED42.3 LED47.1 LED47.3 LED52.1 LED52.3 LED57.1 LED57.3 LED62.1 LED62.3 LED67.1 LED67.3
  Top Layer w1.27: 26.33,7.06 26.33,4.11 U1.7
C7: length 59.2
  Top Layer w0.762: LED68.3 LED68.1 LED63.3 LED63.1 LED58.3 LED58.1 LED53.3 LED53.1 LED48.3 LED48.1 LED43.3 LED43.1 LED38.3 LED38.1 30.62,33.45 30.86,33.21 30.86,7.23 30.8,7.17
  Top Layer w1.27: 30.43,7.2 30.43,2.56 U1.8
C8: length 59.5
  Top Layer w0.762: LED69.3 LED69.1 LED64.3 LED64.1 LED59.3 LED59.1 LED54.3 LED54.1 LED49.3 LED49.1 LED44.3 LED44.1 LED39.3 LED39.1 34.72,33.45 34.96,33.21 34.96,6.41
  Top Layer w1.27: U1.9 34.2,4.83 34.53,5.17 34.53,7.09
C9: length 60.3
  Top Layer w0.762: 39.06,6.41 39.06,33.21 38.82,33.45 LED40.1 LED40.3 LED45.1 LED45.3 LED50.1 LED50.3 LED55.1 LED55.3 LED60.1 LED60.3 LED65.1 LED65.3 LED70.1 LED70.3
  Top Layer w1.27: 38.64,7.24 38.64,3.23 U1.10
C10: length 60.7
  Top Layer w0.762: LED71.1 LED71.3 LED76.1 LED76.3 LED81.1 LED81.3 LED86.1 LED86.3 LED91.1 LED91.3 LED96.1 LED96.3 LED101.1 LED101.3 ; 42.56,33.45 42.93,33.45 43.17,33.21 43.17,6.41
  Top Layer w1.27: U1.11 42.73,4.78 42.73,6.99
C11: length 61.3
  Top Layer w0.762: LED102.3 LED102.1 LED97.3 LED97.1 LED92.3 LED92.1 LED87.3 LED87.1 LED82.3 LED82.1 LED77.3 LED77.1 LED72.3 LED72.1 47.02,33.45 47.26,33.21 47.26,6.41
  Top Layer w1.27: 46.83,6.96 46.83,6.34 U1.12
C12: length 62.5
  Top Layer w0.762: 51.32,6.66 51.36,6.69 51.36,33.21 51.12,33.45 LED73.1 LED73.3 LED78.1 LED78.3 LED83.1 LED83.3 LED88.1 LED88.3 LED93.1 LED93.3 LED98.1 LED98.3 LED103.1 LED103.3
  Top Layer w1.27: U1.13 48.3,5.27 49.68,5.27 50.95,6.54 50.95,6.93
C13: length 65
  Top Layer w0.762: LED104.3 LED104.1 LED99.3 LED99.1 LED94.3 LED94.1 LED89.3 LED89.1 LED84.3 LED84.1 LED79.3 LED79.1 LED74.3 LED74.1 55.22,33.45 55.46,33.21 55.46,6.41
  Top Layer w1.27: 55.04,7.09 55.04,5.95 52.71,3.61 48.77,3.61 46.9,1.74 U1.14
C14: length 66.8
  Top Layer w0.762: LED105.3 LED105.1 LED100.3 LED100.1 LED95.3 LED95.1 LED90.3 LED90.1 LED85.3 LED85.1 LED80.3 LED80.1 LED75.3 LED75.1 59.32,33.45 59.56,33.21 59.56,6.41
  Top Layer w1.27: 59.14,7.2 59.14,5.35 55.12,1.33 U1.15
R0_B: length 61
  Bottom Layer w1.27: H1.2 65.53,31.93 61.92,31.93 61.92,31.94 4.56,31.94 v1(4.55,31.95)
  vias: v1(8.65,31.95) v1(12.75,31.95) v1(16.85,31.95) v1(20.95,31.95) v1(25.05,31.95) v1(29.15,31.95) v1(33.25,31.95) v1(37.35,31.95) v1(41.45,31.95) v1(45.55,31.95) v1(49.65,31.95) v1(53.75,31.95) v1(57.85,31.95) v1(61.95,31.95)
R0_R: length 61.4
  Bottom Layer w1.27: H1.1 62.98,34.48 v1(61.95,33.45) v1(57.85,33.45) v1(53.75,33.45) v1(49.65,33.45) v1(45.55,33.45) v1(41.45,33.45) v1(37.35,33.45) v1(33.25,33.45) v1(29.15,33.45) v1(25.05,33.45) v1(20.95,33.45) v1(16.85,33.45) v1(12.75,33.45) v1(8.65,33.45) v1(4.55,33.45)
R1_B: length 61.4
  Bottom Layer w1.27: v1(4.55,27.85) v1(8.65,27.85) v1(12.75,27.85) v1(16.85,27.85) v1(20.95,27.85) v1(25.05,27.85) v1(29.15,27.85) v1(33.25,27.85) v1(37.35,27.85) v1(41.45,27.85) v1(45.55,27.85) v1(49.65,27.85) v1(53.75,27.85) v1(57.85,27.85) v1(61.95,27.85) 64.54,27.85 H1.4
R1_R: length 61
  Bottom Layer w1.27: H1.3 65.48,29.35 v1(61.95,29.35) v1(57.85,29.35) v1(53.75,29.35) v1(49.65,29.35) v1(45.55,29.35) v1(41.45,29.35) v1(37.35,29.35) v1(33.25,29.35) v1(29.15,29.35) v1(25.05,29.35) v1(20.95,29.35) v1(16.85,29.35) v1(12.75,29.35) v1(8.65,29.35) v1(4.55,29.35)
R2_B: length 61.8
  Bottom Layer w1.27: v1(4.55,23.75) v1(8.65,23.75) v1(12.75,23.75) v1(16.85,23.75) v1(20.95,23.75) v1(25.05,23.75) v1(29.15,23.75) v1(33.25,23.75) v1(37.35,23.75) v1(41.45,23.75) v1(45.55,23.75) v1(49.65,23.75) v1(53.75,23.75) v1(57.85,23.75) v1(61.95,23.75) 63.56,23.75 H1.6
R2_R: length 61.4
  Bottom Layer w1.27: H1.5 64.6,25.25 v1(61.95,25.25) v1(57.85,25.25) v1(53.75,25.25) v1(49.65,25.25) v1(45.55,25.25) v1(41.45,25.25) v1(37.35,25.25) v1(33.25,25.25) v1(29.15,25.25) v1(25.05,25.25) v1(20.95,25.25) v1(16.85,25.25) v1(12.75,25.25) v1(8.65,25.25) v1(4.55,25.25)
R3_B: length 62.2
  Bottom Layer w1.27: v1(4.55,19.65) v1(8.65,19.65) v1(12.75,19.65) v1(16.85,19.65) v1(20.95,19.65) v1(25.05,19.65) v1(29.15,19.65) v1(33.25,19.65) v1(37.35,19.65) v1(41.45,19.65) v1(45.55,19.65) v1(49.65,19.65) v1(53.75,19.65) v1(57.85,19.65) v1(61.95,19.65) 62.58,19.65 H1.8
R3_R: length 61.8
  Bottom Layer w1.27: v1(4.55,21.15) v1(8.65,21.15) v1(12.75,21.15) v1(16.85,21.15) v1(20.95,21.15) v1(25.05,21.15) v1(29.15,21.15) v1(33.25,21.15) v1(37.35,21.15) v1(41.45,21.15) v1(45.55,21.15) v1(49.65,21.15) v1(53.75,21.15) v1(57.85,21.15) v1(61.95,21.15) 63.49,21.15 65.41,19.24 H1.7
R4_B: length 57.4
  Bottom Layer w1.27: v1(61.95,15.55) v1(57.85,15.55) v1(53.75,15.55) v1(49.65,15.55) v1(45.55,15.55) v1(41.45,15.55) v1(37.35,15.55) v1(33.25,15.55) v1(29.15,15.55) v1(25.05,15.55) v1(20.95,15.55) v1(16.85,15.55) v1(12.75,15.55) v1(8.65,15.55) v1(4.55,15.55)
R4_R: length 62.3
  Bottom Layer w1.27: H1.9 65.53,14.31 62.79,17.05 v1(61.95,17.05) v1(57.85,17.05) v1(53.75,17.05) v1(49.65,17.05) v1(45.55,17.05) v1(41.45,17.05) v1(37.35,17.05) v1(33.25,17.05) v1(29.15,17.05) v1(25.05,17.05) v1(20.95,17.05) v1(16.85,17.05) v1(12.75,17.05) v1(8.65,17.05) v1(4.55,17.05)
R5_B: length 53.3
  Bottom Layer w1.27: v1(4.55,11.45) v1(8.65,11.45) v1(12.75,11.45) v1(16.85,11.45) v1(20.95,11.45) v1(25.05,11.45) v1(29.15,11.45) v1(33.25,11.45) v1(37.35,11.45) v1(41.45,11.45) v1(45.55,11.45) v1(49.65,11.45) v1(53.75,11.45) v1(57.85,11.45)
  vias: v1(61.95,11.45)
R5_R: length 57.4
  Bottom Layer w1.27: v1(4.55,12.95) v1(8.65,12.95) v1(12.75,12.95) v1(16.85,12.95) v1(20.95,12.95) v1(25.05,12.95) v1(29.15,12.95) v1(33.25,12.95) v1(37.35,12.95) v1(41.45,12.95) v1(45.55,12.95) v1(49.65,12.95) v1(53.75,12.95) v1(57.85,12.95) v1(61.95,12.95)
R6_B: length 57.4
  Bottom Layer w1.27: v1(61.95,7.35) v1(57.85,7.35) v1(53.75,7.35) v1(49.65,7.35) v1(45.55,7.35) v1(41.45,7.35) v1(37.35,7.35) v1(33.25,7.35) v1(29.15,7.35) v1(25.05,7.35) v1(20.95,7.35) v1(16.85,7.35) v1(12.75,7.35) v1(8.65,7.35) v1(4.55,7.35)
R6_R: length 57.4
  Bottom Layer w1.27: v1(61.95,8.85) v1(57.85,8.85) v1(53.75,8.85) v1(49.65,8.85) v1(45.55,8.85) v1(41.45,8.85) v1(37.35,8.85) v1(33.25,8.85) v1(29.15,8.85) v1(25.05,8.85) v1(20.95,8.85) v1(16.85,8.85) v1(12.75,8.85) v1(8.65,8.85) v1(4.55,8.85)

## Copper pours and planes (outline as drawn; the poured copper is in the pictures)
(no net) on Bottom Layer: 43.74,6.28 44.25,5.77 44.25,3.2 43.75,2.71 19.71,2.71 19.18,3.23 19.18,5.77 19.69,6.28
R4_B on Bottom Layer: 62.03,16.18 62.24,16.18 64.39,14.02 64.39,13.66 65.28,12.77 65.85,12.77 66.67,11.95 66.67,11.03 66.12,10.49 65.06,10.49 64.4,11.15 64.4,11.96 63.44,12.93 63.44,13.05 61.57,14.92 61.57,15.71
R5_B on Top Layer: 61.57,12.2 62.9,12.2 64.24,10.86 64.24,8.72 65.09,7.87 65.84,7.87 66.67,7.04 66.67,5.94 66.21,5.48 64.8,5.48 64.47,5.81 64.47,5.92 62.68,7.71 62.68,9.36 61.2,10.84 61.2,11.84
R5_B on Bottom Layer: 57.8,12.07 62.23,12.07 62.46,11.83 62.46,10.96 62.47,10.95 62.33,10.81 57.74,10.81 57.37,11.18 57.37,11.64
R5_R on Bottom Layer: 62.07,13.58 62.54,13.58 63.19,12.93 63.19,12.79 64.14,11.84 64.14,10.89 64.84,10.2 65.9,10.2 66.67,9.43 66.67,8.44 66.12,7.9 65.09,7.9 64.5,8.49 64.5,8.93 62.89,10.54 62.89,11.67 62.24,12.32 62.01,12.32 62.01,13.52
R6_B on Bottom Layer: 62.19,7.97 62.91,7.24 62.91,4 64.3,2.61 65.82,2.61 66.59,1.84 66.59,0.94 66.11,0.46 64.33,0.46 60.68,4.11 60.68,6.2 60.12,6.76 60.12,6.85 61.24,7.97
R6_R on Bottom Layer: 61.9,9.48 63.42,9.48 64.28,8.61 64.28,7.89 64.35,7.83 64.35,5.95 65,5.3 66,5.3 66.67,4.62 66.67,3.46 66.17,2.96 64.67,2.96 63.12,4.51 63.12,7.56 62.45,8.23 61.77,8.23 61.56,8.44 61.9,8.77

## Text on the board
Bottom Solder Mask Layer: 2024/04/08 | HFUT(XC) | 宛陵毕方 | 代鹏涛 申杰文
Bottom Silkscreen Layer: 藤原とうふ店(自家用)
Top Silkscreen Layer: C0 | C1 | C2 | C3 | C4 | C5 | C6 | C7 | C8 | C9 | C10 | C11 | C12 | C13 | C14 | R0 | R1 | R2 | R3 | R4 | R5 | R6
